# Altium schematic sheet DS135-1.0-B浊度传感器.SchDoc
size A4
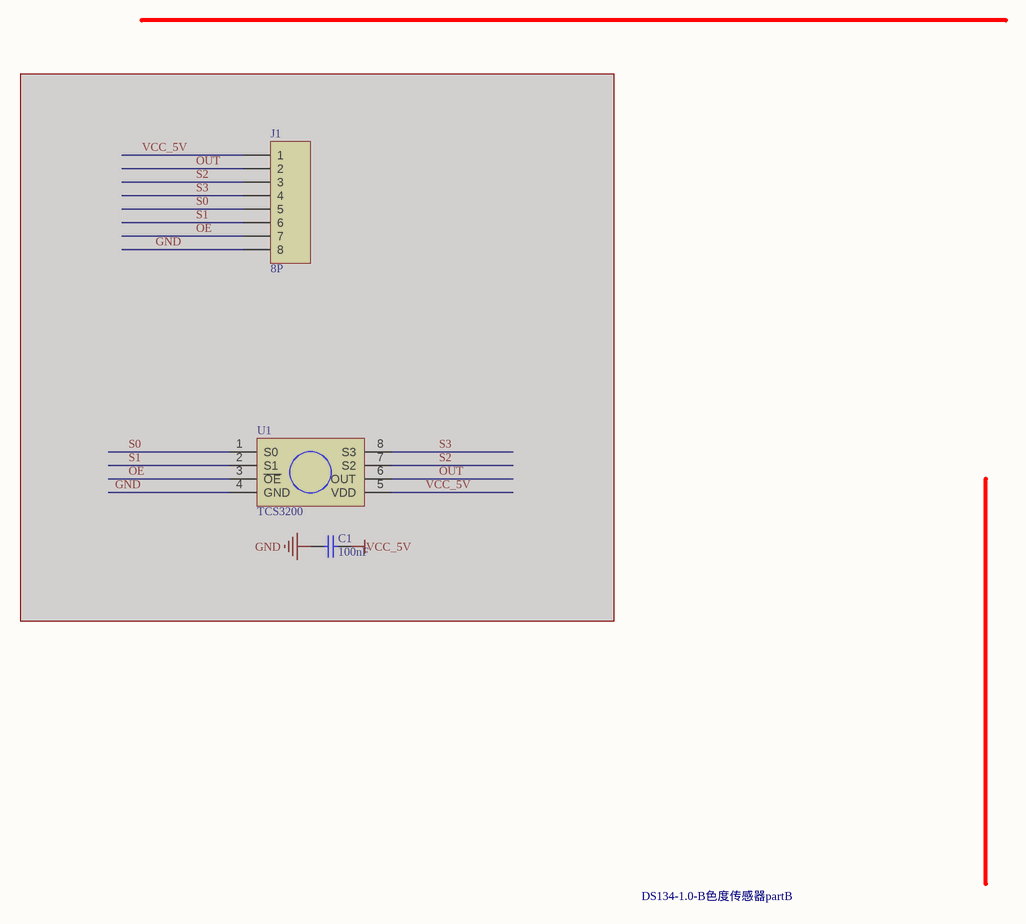
[diagram p0: DS135-1.0-B浊度传感器.SchDoc]

## Parts
C1  value 100nF  [0805CAP]  (hidden comment: SMDCAP00014)  (masked out: inside a compile mask, not in the netlist)
J1  value 8P  [SIP8]  (hidden comment: SL000000042)  (masked out: inside a compile mask, not in the netlist)
U1  TCS3200  [SO-8]  (masked out: inside a compile mask, not in the netlist)

## Notes on the sheet
- DS134-1.0-B色度传感器partB
- DWG. NO.
- REV.
- SHT.
- THIS DOCUMENT AND THE DATA DISCLOSED HEREIN OR HEREWITH IS THE PROPERTY OF ALTIUM LIMITED AND MAY BE FREELY DISTRIBUTED IN WHOLE. NO RIGHTS ARE RESERVED OR EXPRESS OR IMPLIED WARANTEE GIVEN.
- REVISION
- DESCRIPTION
- DATE
- APPROVED
- ENG:
- APPROVALS
- PROJECT
- DSN:
- CHK:
- REFERENCE DOCUMENTS
- PROJECT REVISION:
- TITLE
- DOCUMENT REVISION:
- DESIGN ITEM:
- BOM:
- FAB DWG:
- PCB DWG:
- ASSY DWG:
- SCALE:
- SIZE
- B
- CAGE CODE
- FILE NAME
- DWG NO.
- SHEET
- OF
- REV

## Library data of the parts
C1 = MLCC 100nF 50V ±10％ 0805: 贴片电容
J1 = DIP8 单排直针 1*40P 间距2.54mm 针长11mm 铜: 单排直针